# EasyEDA Pro project ProPrj_FOC_Driver V2.0_2024-06-09.epro, schematic v1.0
Create Date: 2023-11-04; Page Name: FOC_Driver; Project Name: FOC_Driver; Schematic Name: Schematic1; Update Date: 2024-03-01; Company: 嘉立创EDA; Page Size: A2; Version: V1.0
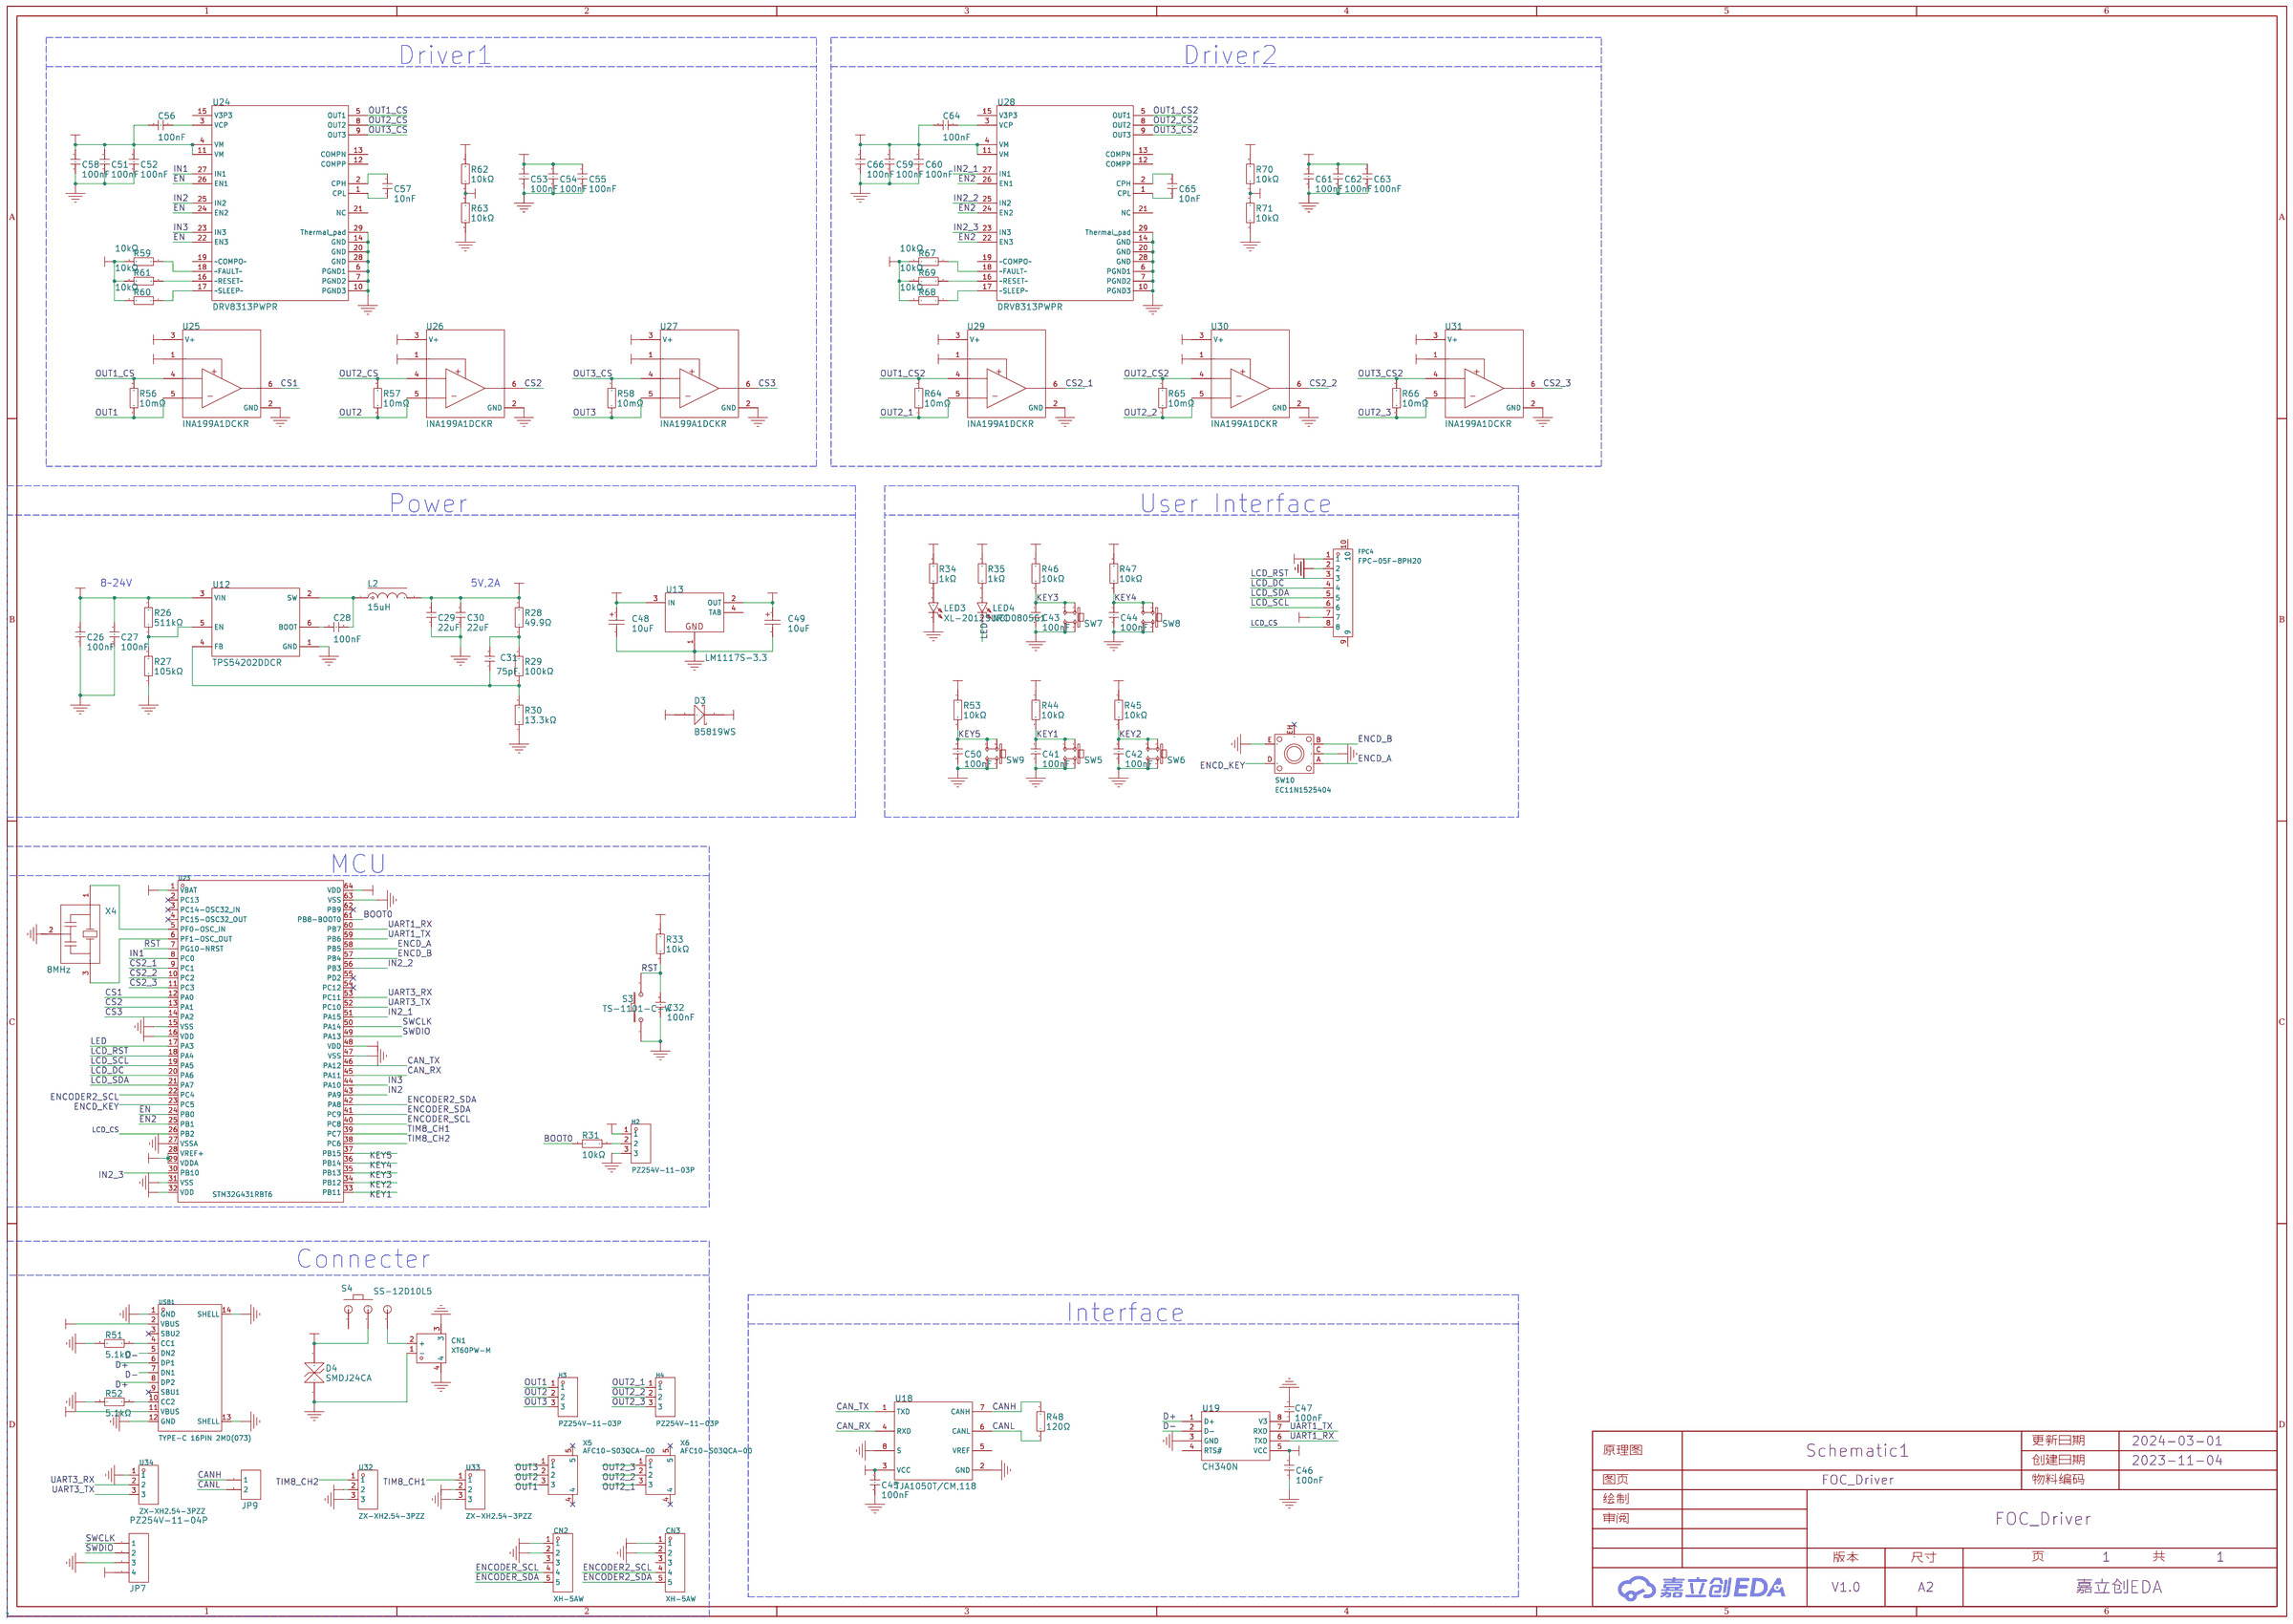
[diagram p0: schematic sheet]

## Parts
C26  100nF  [C0603]
C27  100nF  [C0603]
C28  100nF  [C0603]
C29  22uF  [C0805]
C30  22uF  [C0805]
C31  75pF  [C0603]
C32  100nF  [C0603]
C41  100nF  [C0603]
C42  100nF  [C0603]
C43  100nF  [C0603]
C44  100nF  [C0603]
C45  100nF  [C0603]
C46  100nF  [C0603]
C47  100nF  [C0603]
C48  10uF  [CAP-SMD_L3.2-W1.6-RD-C7171]
C49  10uF  [CAP-SMD_L3.2-W1.6-RD-C7171]
C50  100nF  [C0603]
C51  100nF  [C0603]
C52  100nF  [C0603]
C53  100nF  [C0603]
C54  100nF  [C0603]
C55  100nF  [C0603]
C56  100nF  [C0603]
C57  10nF  [C0603]
C58  100nF  [C0603]
C59  100nF  [C0603]
C60  100nF  [C0603]
C61  100nF  [C0603]
C62  100nF  [C0603]
C63  100nF  [C0603]
C64  100nF  [C0603]
C65  10nF  [C0603]
C66  100nF  [C0603]
CN1  XT60PW-M  [CONN-TH_XT60PW-M]
CN2  XH-5AW  [CONN-TH_5P-P2.54_XH-5AW_C2908614]
CN3  XH-5AW  [CONN-TH_5P-P2.54_XH-5AW_C2908614]
D3  B5819WS  [SOD-323_L1.8-W1.3-LS2.5-RD]
D4  SMDJ24CA  [SMC_L6.9-W5.9-LS7.9-BI]
FPC4  FPC-05F-8PH20  [FPC-SMD_8P-P0.50_FPC-05F-8PH20]
H2  PZ254V-11-03P  [HDR-TH_3P-P2.54-V-M]
H3  PZ254V-11-03P  [HDR-TH_3P-P2.54-V-M]
H4  PZ254V-11-03P  [HDR-TH_3P-P2.54-V-M]
JP7  PZ254V-11-04P  [HDR-TH_4P-P2.54-V-M]
JP9  XH-2A  [CONN-TH_2P-P2.50_HCTL_XH-2A-X]
L2  15uH  [IND-SMD_L4.0-W4.0]
LED3  XL-2012SURC  [LED0805-RD_RED]
LED4  NCD0805G1  [LED0805-R-RD]
R26  511kΩ  [R0805]
R27  105kΩ  [R0603]
R28  49.9Ω  [R0603]
R29  100kΩ  [R0603]
R30  13.3kΩ  [R0603]
R31  10kΩ  [R0603]
R33  10kΩ  [R0603]
R34  1kΩ  [R0603]
R35  1kΩ  [R0603]
R44  10kΩ  [R0603]
R45  10kΩ  [R0603]
R46  10kΩ  [R0603]
R47  10kΩ  [R0603]
R48  120Ω  [R0603]
R51  5.1kΩ  [R0603]
R52  5.1kΩ  [R0603]
R53  10kΩ  [R0603]
R56  10mΩ  [RES-SMD_L6.4-W3.2-R2512]
R57  10mΩ  [RES-SMD_L6.4-W3.2-R2512]
R58  10mΩ  [RES-SMD_L6.4-W3.2-R2512]
R59  10kΩ  [R0603]
R60  10kΩ  [R0603]
R61  10kΩ  [R0603]
R62  10kΩ  [R0603]
R63  10kΩ  [R0603]
R64  10mΩ  [RES-SMD_L6.4-W3.2-R2512]
R65  10mΩ  [RES-SMD_L6.4-W3.2-R2512]
R66  10mΩ  [RES-SMD_L6.4-W3.2-R2512]
R67  10kΩ  [R0603]
R68  10kΩ  [R0603]
R69  10kΩ  [R0603]
R70  10kΩ  [R0603]
R71  10kΩ  [R0603]
S3  TS-1101-C-W  [SW-SMD_L6.0-W3.3-LS8.0]
S4  SS-12D10L5  [SW-TH_SS-12D10L5]
SW5  K2-1102SP-C3SC-04  [SW-SMD_4P-L6.0-W6.0-P4.50-LS9.0]
SW6  K2-1102SP-C3SC-04  [SW-SMD_4P-L6.0-W6.0-P4.50-LS9.0]
SW7  K2-1102SP-C3SC-04  [SW-SMD_4P-L6.0-W6.0-P4.50-LS9.0]
SW8  K2-1102SP-C3SC-04  [SW-SMD_4P-L6.0-W6.0-P4.50-LS9.0]
SW9  K2-1102SP-C3SC-04  [SW-SMD_4P-L6.0-W6.0-P4.50-LS9.0]
SW10  EC11N1525404  [SW-TH_EC11NXXXX]
U12  TPS54202DDCR  [SOT-23-6_L2.9-W1.6-P0.95-LS2.8-BL]
U13  LM1117S-3.3  [SOT-223-3_L6.5-W3.4-P2.30-LS7.0-BR]
U18  TJA1050T/CM,118  [SOIC-8_L5.0-W4.0-P1.27-LS6.0-BL]
U19  CH340N  [SOP-8_L4.9-W3.9-P1.27-LS6.0-BL]
U23  STM32G431RBT6  [LQFP-64_L10.0-W10.0-P0.50-LS12.0-BL]
U24  DRV8313PWPR  [HTSSOP-28_L9.8-W4.5-P0.65-LS6.6-BL-EP]
U25  INA199A1DCKR  [SC-70-6_L2.2-W1.3-P0.65-LS2.1-BR]
U26  INA199A1DCKR  [SC-70-6_L2.2-W1.3-P0.65-LS2.1-BR]
U27  INA199A1DCKR  [SC-70-6_L2.2-W1.3-P0.65-LS2.1-BR]
U28  DRV8313PWPR  [HTSSOP-28_L9.8-W4.5-P0.65-LS6.6-BL-EP]
U29  INA199A1DCKR  [SC-70-6_L2.2-W1.3-P0.65-LS2.1-BR]
U30  INA199A1DCKR  [SC-70-6_L2.2-W1.3-P0.65-LS2.1-BR]
U31  INA199A1DCKR  [SC-70-6_L2.2-W1.3-P0.65-LS2.1-BR]
U32  ZX-XH2.54-3PZZ  [CONN-TH_3P-P2.54_2501S-3P]
U33  ZX-XH2.54-3PZZ  [CONN-TH_3P-P2.54_2501S-3P]
U34  ZX-XH2.54-3PZZ  [CONN-TH_3P-P2.54_2501S-3P]
USB1  TYPE-C 16PIN 2MD(073)  [USB-C-SMD_TYPE-C-6PIN-2MD-073]
X4  8MHz  [OSC-SMD_3P-L3.2-W1.3-P1.2-L]
X5  AFC10-S03QCA-00  [CONN-SMD_AFC10-S03QCA-00]
X6  AFC10-S03QCA-00  [CONN-SMD_AFC10-S03QCA-00]

## Library data of the parts
C26 C58 C66 = CC0603KRX7R9BB104: 容值:100nF;精度:±10%;额定电压:50V;材质(温度系数):X7R;; LCSC Part Name: 100nF ±10% 50V; Supplier Part: C14663; Manufacturer: YAGEO(国巨); Supplier Footprint: 0603; JLCPCB Part Class: Basic Part; Datasheet: https://atta.szlcsc.com/upload/public/pdf/source/20180910/C282072_33301C7F631E79921B82A8DAC6BCC5B3.pdf; Supplier: LCSC; Tolerance: ±10%; Voltage Rated: 50V; Temperature Coefficient: X7R; Origin Footprint 1: C 1206_M; Design Item ID: C; Library Name: 0.1 - 电阻-电容-电感; BOM名称: 无极性贴片电容; 淘宝ID: 封装库来自淘宝 ID：黄晶宝石; 联系售后，技术支持: https://shop463601444.taobao.com; 唯一出售店铺网址: https://shop463601444.taobao.com; Origin Footprint 2: C 0201_L; Origin Footprint 3: C 0402_L; Origin Footprint 4: C 0603_L; Origin Footprint 5: C 0805_L; Origin Footprint 6: C 1206_L; Origin Footprint 7: C 1210_L; Origin Footprint 8: C 1808_L; Origin Footprint 9: C 1812_L; Origin Footprint 10: C 1825_L; Origin Footprint 11: C 2225_L; Origin Footprint 12: C 0201_M; Origin Footprint 13: C 0402_M; Origin Footprint 14: C 0603_M; Origin Footprint 15: C 0805_M; Origin Footprint 16: C 1210_M; Origin Footprint 17: C 1808_M; Origin Footprint 18: C 1812_M; Origin Footprint 19: C 1825_M; Origin Footprint 20: C 2225_M
C27 = CC0603KRX7R9BB104: 容值:100nF;精度:±10%;额定电压:50V;材质(温度系数):X7R;; LCSC Part Name: 100nF ±10% 50V; Supplier Part: C14663; Manufacturer: YAGEO(国巨); Supplier Footprint: 0603; JLCPCB Part Class: Basic Part; Datasheet: https://atta.szlcsc.com/upload/public/pdf/source/20180910/C282072_33301C7F631E79921B82A8DAC6BCC5B3.pdf; Supplier: LCSC; Tolerance: ±10%; Voltage Rated: 50V; Temperature Coefficient: X7R; Origin Footprint 1: C 0603_M; Design Item ID: C; Library Name: 0.1 - 电阻-电容-电感; BOM名称: 无极性贴片电容; 淘宝ID: 封装库来自淘宝 ID：黄晶宝石; 联系售后，技术支持: https://shop463601444.taobao.com; 唯一出售店铺网址: https://shop463601444.taobao.com; Origin Footprint 2: C 0201_L; Origin Footprint 3: C 0402_L; Origin Footprint 4: C 0603_L; Origin Footprint 5: C 0805_L; Origin Footprint 6: C 1206_L; Origin Footprint 7: C 1210_L; Origin Footprint 8: C 1808_L; Origin Footprint 9: C 1812_L; Origin Footprint 10: C 1825_L; Origin Footprint 11: C 2225_L; Origin Footprint 12: C 0201_M; Origin Footprint 13: C 0402_M; Origin Footprint 14: C 0805_M; Origin Footprint 15: C 1206_M; Origin Footprint 16: C 1210_M; Origin Footprint 17: C 1808_M; Origin Footprint 18: C 1812_M; Origin Footprint 19: C 1825_M; Origin Footprint 20: C 2225_M; Rated Voltage: 50V; Equivalent Series Resistance(ESR): 20Ω; Operating Temperature: -55℃~+125℃
C28 C41-C47 C50-C55 C59-C63 = 0603B104K500NT: 容值:100nF;精度:±10%;额定电压:50V;材质(温度系数):X7R;; LCSC Part Name: 100nF ±10% 50V; Supplier Part: C30926; Manufacturer: FH(风华); Supplier Footprint: 0603; JLCPCB Part Class: Extended Part; Datasheet: https://atta.szlcsc.com/upload/public/pdf/source/20170923/C30926_1506149436298988724.pdf; Supplier: LCSC; Tolerance: ±10%; Voltage Rated: 50V; Temperature Coefficient: X7R; Origin Footprint 1: C 0603_M; Design Item ID: C; Library Name: 0.1 - 电阻-电容-电感; BOM名称: 无极性贴片电容; 淘宝ID: 封装库来自淘宝 ID：黄晶宝石; 联系售后，技术支持: https://shop463601444.taobao.com; 唯一出售店铺网址: https://shop463601444.taobao.com; Origin Footprint 2: C 0201_L; Origin Footprint 3: C 0402_L; Origin Footprint 4: C 0603_L; Origin Footprint 5: C 0805_L; Origin Footprint 6: C 1206_L; Origin Footprint 7: C 1210_L; Origin Footprint 8: C 1808_L; Origin Footprint 9: C 1812_L; Origin Footprint 10: C 1825_L; Origin Footprint 11: C 2225_L; Origin Footprint 12: C 0201_M; Origin Footprint 13: C 0402_M; Origin Footprint 14: C 0805_M; Origin Footprint 15: C 1206_M; Origin Footprint 16: C 1210_M; Origin Footprint 17: C 1808_M; Origin Footprint 18: C 1812_M; Origin Footprint 19: C 1825_M; Origin Footprint 20: C 2225_M
C29 C30 = CL21A226MAQNNNE_C45783: 容值:22uF;精度:±20%;额定电压:25V;材质(温度系数):X5R;; LCSC Part Name: 22uF ±20% 25V; Supplier Part: C45783; Manufacturer: SAMSUNG(三星); Manufacturer Part: CL21A226MAQNNNE; Supplier Footprint: 0805; JLCPCB Part Class: Basic Part; Datasheet: https://atta.szlcsc.com/upload/public/pdf/source/20160218/1457707763339.pdf; Supplier: LCSC; Tolerance: ±20%; Voltage Rated: 25V; Temperature Coefficient: X5R; Origin Footprint 1: C 1206_M; Design Item ID: C; Library Name: 0.1 - 电阻-电容-电感; BOM名称: 无极性贴片电容; 淘宝ID: 封装库来自淘宝 ID：黄晶宝石; 联系售后，技术支持: https://shop463601444.taobao.com; 唯一出售店铺网址: https://shop463601444.taobao.com; Origin Footprint 2: C 0201_L; Origin Footprint 3: C 0402_L; Origin Footprint 4: C 0603_L; Origin Footprint 5: C 0805_L; Origin Footprint 6: C 1206_L; Origin Footprint 7: C 1210_L; Origin Footprint 8: C 1808_L; Origin Footprint 9: C 1812_L; Origin Footprint 10: C 1825_L; Origin Footprint 11: C 2225_L; Origin Footprint 12: C 0201_M; Origin Footprint 13: C 0402_M; Origin Footprint 14: C 0603_M; Origin Footprint 15: C 0805_M; Origin Footprint 16: C 1210_M; Origin Footprint 17: C 1808_M; Origin Footprint 18: C 1812_M; Origin Footprint 19: C 1825_M; Origin Footprint 20: C 2225_M
C31 = CC0603JRNPO9BN750: 容值:75pF;精度:±5%;额定电压:50V;材质(温度系数):NP0;; LCSC Part Name: 75pF ±5% 50V; Supplier Part: C282074; Manufacturer: YAGEO(国巨); Supplier Footprint: 0603; JLCPCB Part Class: Extended Part; Datasheet: https://atta.szlcsc.com/upload/public/pdf/source/20180910/C282074_CCE1E273F5501B7CA79887634C3253BB.pdf; Supplier: LCSC; Tolerance: ±5%; Voltage Rated: 50V; Temperature Coefficient: NP0; Origin Footprint 1: C 0603_M; Design Item ID: C; Library Name: 0.1 - 电阻-电容-电感; BOM名称: 无极性贴片电容; 淘宝ID: 封装库来自淘宝 ID：黄晶宝石; 联系售后，技术支持: https://shop463601444.taobao.com; 唯一出售店铺网址: https://shop463601444.taobao.com; Origin Footprint 2: C 0201_L; Origin Footprint 3: C 0402_L; Origin Footprint 4: C 0603_L; Origin Footprint 5: C 0805_L; Origin Footprint 6: C 1206_L; Origin Footprint 7: C 1210_L; Origin Footprint 8: C 1808_L; Origin Footprint 9: C 1812_L; Origin Footprint 10: C 1825_L; Origin Footprint 11: C 2225_L; Origin Footprint 12: C 0201_M; Origin Footprint 13: C 0402_M; Origin Footprint 14: C 0805_M; Origin Footprint 15: C 1206_M; Origin Footprint 16: C 1210_M; Origin Footprint 17: C 1808_M; Origin Footprint 18: C 1812_M; Origin Footprint 19: C 1825_M; Origin Footprint 20: C 2225_M
C32 = 0603B104K500NT: 容值:100nF;精度:±10%;额定电压:50V;材质(温度系数):X7R;; LCSC Part Name: 100nF ±10% 50V; Supplier Part: C30926; Manufacturer: FH(风华); Supplier Footprint: 0603; JLCPCB Part Class: Extended Part; Datasheet: https://atta.szlcsc.com/upload/public/pdf/source/20170923/C30926_1506149436298988724.pdf; Supplier: LCSC; Tolerance: ±10%; Voltage Rated: 50V; Temperature Coefficient: X7R; Origin Footprint 1: C 0603_L; Design Item ID: C; Library Name: 0.1 - 电阻-电容-电感; BOM名称: 无极性贴片电容; 淘宝ID: 封装库来自淘宝 ID：黄晶宝石; 联系售后，技术支持: https://shop463601444.taobao.com; 唯一出售店铺网址: https://shop463601444.taobao.com; Origin Footprint 2: C 0201_L; Origin Footprint 3: C 0402_L; Origin Footprint 4: C 0805_L; Origin Footprint 5: C 1206_L; Origin Footprint 6: C 1210_L; Origin Footprint 7: C 1808_L; Origin Footprint 8: C 1812_L; Origin Footprint 9: C 1825_L; Origin Footprint 10: C 2225_L; Origin Footprint 11: C 0201_M; Origin Footprint 12: C 0402_M; Origin Footprint 13: C 0603_M; Origin Footprint 14: C 0805_M; Origin Footprint 15: C 1206_M; Origin Footprint 16: C 1210_M; Origin Footprint 17: C 1808_M; Origin Footprint 18: C 1812_M; Origin Footprint 19: C 1825_M; Origin Footprint 20: C 2225_M
C48 C49 = TAJA106K016RNJ: 容值:10uF;精度:±10%;额定电压:16V;等效串联电阻:3Ω@100kHz;; LCSC Part Name: 10uF ±10% 16V; Supplier Part: C7171; Manufacturer: Kyocera AVX; Supplier Footprint: CASE-A-3216; JLCPCB Part Class: Basic Part; Datasheet: https://atta.szlcsc.com/upload/public/pdf/source/20160107/1457707748093.pdf; Supplier: LCSC; Tolerance: ±10%; Rated Voltage: 16V; Equivalent Series Resistance(ESR): 3Ω@100kHz; Operating Temperature: -55℃~+125℃; Voltage Rated: 25V; Temperature Coefficient: X5R; Design Item ID: CMP-1661-00004-1; Library Name: Altium Content Vault; Min Operating Temperature: -55 degC; Width: 1.7 mm; ComponentLink2URL: http://datasheets.avx.com/TAJ.pdf; PackageDescription: 2-Pin Surface Mount Device, Body 3.2 x 1.65 mm; RoHSCompliant: true; ComponentLink2Description: Datasheet; Package Quantity: 3000; Max Operating Temperature: 150 degC; Length: 3.1 mm; Frequency: 300 MHz; Mount: Surface Mount; Vce Max: 500 mV; Packaging: Tape and Reel; ComponentLink1URL: http://www.avx.com/; ComponentLink1Description: Manufacturer URL; DatasheetVersion: Feb-16; ComponentLink3URL: http://www.avx.com/download/software/literature/AVX-Footprint-Library.pdf; ComponentLink3Description: Package Specification; hFE Min: 60; Elements: 2; Height: 1.3 mm; PackageReference: CAPMP3217X18-T; Case\Package: SOT-26; REACH SVHC: No SVHC; Pins: 6; Radiation Hardening: No; Max Power Dissipation: 300 mW
C56 C64 = CC0603KRX7R7BB104: 容值:100nF;精度:±10%;额定电压:16V;材质(温度系数):X7R;; LCSC Part Name: 100nF ±10% 16V; Supplier Part: C108079; Manufacturer: YAGEO(国巨); Supplier Footprint: 0603; JLCPCB Part Class: Extended Part; Datasheet: https://atta.szlcsc.com/upload/public/pdf/source/20180521/C108079_E7FC8AA4882E2CE01D16840ADD99E4BD.pdf; Supplier: LCSC; Tolerance: ±10%; Voltage Rated: 16V; Temperature Coefficient: X7R; Origin Footprint 1: C 0603_M; Design Item ID: C; Library Name: 0.1 - 电阻-电容-电感; BOM名称: 无极性贴片电容; 淘宝ID: 封装库来自淘宝 ID：黄晶宝石; 联系售后，技术支持: https://shop463601444.taobao.com; 唯一出售店铺网址: https://shop463601444.taobao.com; Origin Footprint 2: C 0201_L; Origin Footprint 3: C 0402_L; Origin Footprint 4: C 0603_L; Origin Footprint 5: C 0805_L; Origin Footprint 6: C 1206_L; Origin Footprint 7: C 1210_L; Origin Footprint 8: C 1808_L; Origin Footprint 9: C 1812_L; Origin Footprint 10: C 1825_L; Origin Footprint 11: C 2225_L; Origin Footprint 12: C 0201_M; Origin Footprint 13: C 0402_M; Origin Footprint 14: C 0805_M; Origin Footprint 15: C 1206_M; Origin Footprint 16: C 1210_M; Origin Footprint 17: C 1808_M; Origin Footprint 18: C 1812_M; Origin Footprint 19: C 1825_M; Origin Footprint 20: C 2225_M
C57 C65 = CC0603KRX7R0BB103: 容值:10nF;精度:±10%;额定电压:100V;材质(温度系数):X7R;; LCSC Part Name: 10nF ±10% 100V; Supplier Part: C107059; Manufacturer: YAGEO(国巨); Supplier Footprint: 0603; JLCPCB Part Class: Extended Part; Datasheet: https://atta.szlcsc.com/upload/public/pdf/source/20180327/C107059_A5496CC52303C7A95A2E44D09B52A486.pdf; Supplier: LCSC; Tolerance: ±10%; Voltage Rated: 100V; Temperature Coefficient: X7R; Origin Footprint 1: C 0603_M; Design Item ID: C; Library Name: 0.1 - 电阻-电容-电感; BOM名称: 无极性贴片电容; 淘宝ID: 封装库来自淘宝 ID：黄晶宝石; 联系售后，技术支持: https://shop463601444.taobao.com; 唯一出售店铺网址: https://shop463601444.taobao.com; Origin Footprint 2: C 0201_L; Origin Footprint 3: C 0402_L; Origin Footprint 4: C 0603_L; Origin Footprint 5: C 0805_L; Origin Footprint 6: C 1206_L; Origin Footprint 7: C 1210_L; Origin Footprint 8: C 1808_L; Origin Footprint 9: C 1812_L; Origin Footprint 10: C 1825_L; Origin Footprint 11: C 2225_L; Origin Footprint 12: C 0201_M; Origin Footprint 13: C 0402_M; Origin Footprint 14: C 0805_M; Origin Footprint 15: C 1206_M; Origin Footprint 16: C 1210_M; Origin Footprint 17: C 1808_M; Origin Footprint 18: C 1812_M; Origin Footprint 19: C 1825_M; Origin Footprint 20: C 2225_M
CN1 = XT60PW-M: 模型锂电连接器; LCSC Part Name: AMASS(艾迈斯)航模插头xt90连接器150公母对接pw锂电池公头 板插卧式XT60PW-M; Supplier Part: C98732; Manufacturer: AMASS(艾迈斯); JLCPCB Part Class: Extended Part; Datasheet: https://atta.szlcsc.com/upload/public/pdf/source/20180125/C98732_15168617837851301983.pdf; Supplier: LCSC
CN2 CN3 = XH-5AW: 参考系列:XH;间距:2.54mm;插针结构:1x5P;排数:1;每排PIN数:5;行距:-;公母:公型插针;安装方式:弯插;额定电流:3A;工作温度范围:-25℃~+85℃;; LCSC Part Name: 系列:XH 间距:2.54mm 1x5P 弯插; Supplier Part: C2908614; Manufacturer: HCTL(华灿天禄); Supplier Footprint: 弯插,P=2.54mm; JLCPCB Part Class: Extended Part; Datasheet: https://atta.szlcsc.com/upload/public/pdf/source/20230711/B565BAF3B11666EF6B81B3605408F2BD.pdf; Supplier: LCSC; Reference Series: XH; Pitch: 2.54mm; Pins Structure: 1x5P; Number of Rows: 1; Number of PINs Per Row: 5; Gender: 公型插针; Mounting Style: 弯插; Current Rating (Max): 3A; Operating Temperature Range: -25℃~+85℃
D3 = B5819WS_C22624: 直流反向耐压(Vr):40V;平均整流电流(Io):1A;正向压降(Vf):600mV@1A;; LCSC Part Name: 40V 1A 600mV@1A; Supplier Part: C22624; Manufacturer: CJ(江苏长电/长晶); Supplier Footprint: SOD-323; JLCPCB Part Class: Extended Part; Datasheet: https://atta.szlcsc.com/upload/public/pdf/source/20170919/C22624_1505799673448977596.pdf; Supplier: LCSC; Reverse Voltage (Vr): 40V; Average Rectified Current (Io): 1A; Forward Voltage (Vf@If): 600mV@1A; Design Item ID: 1N5819; Library Name: 0.2 - 二极管-整流桥; BOM名称: 肖特基二极管; 欢迎光临: https://shop463601444.taobao.com; 淘宝ID: 封装库来自淘宝 ID：黄晶宝石; 属性: 40V/2A
D4 = SMDJ24CA_C511913: DO-214AB   3000W  VRWM=24V 双向 功率TVS 电源口等; Supplier Part: C511913; Manufacturer: BORN(伯恩半导体); Supplier Footprint: SMC; JLCPCB Part Class: Extended Part; Datasheet: https://atta.szlcsc.com/upload/public/pdf/source/20200413/C152077_2BEB0A19CF219C0016744A470088E912.pdf; Supplier: LCSC; Polarity: 双向; Reverse Stand-Off Voltage (Vrwm): 24V; Breakdown Voltage: 26.7V; Reverse Leakage Current (Ir): 1uA; Peak Pulse Current (Ipp)@10/1000μs: 15.5A; Maximum Clamping Voltage: 38.9V; Design Item ID: CMP-2000-07094-1; Library Name: Altium Content Vault; Clamping Voltage Vc Max: 38.9V; Peak Pulse Current Ippm: 14A; Mounting Technology: SurfaceMount; Package Reference: DO-214AA; Product Range: TRANSZORBSMBJSeries; Package Description: 2-Pin Surface Mount Device, Body 4.315 x 3.62 mm; Diode Case Style: DO-214AA; Power Dissipation Pd: 600W; Packaging: CutTape; Breakdown Voltage Min: 26.7V; Datasheet URL: http://www.vishay.com/docs/88392/smbj50a.pdf; No_ of Pins: 2Pins; Peak Pulse Power Dissipation: 600W; SVHC: ToBeAdvised; Manufacturer URL: http://www.vishay.com/; Breakdown Voltage Max: 29.5V; Datasheet Version: 02/2014; TVS Polarity: Bidirectional; Reverse Stand-Off Voltage Vrwm: 24V
FPC4 = FPC-05F-8PH20: 间距:0.5mm;触点数量:8P;锁定特性:翻盖式;安装类型:卧贴;触点类型:下接;工作温度范围:-25℃~+85℃;; LCSC Part Name: 0.5mm P数:8P 翻盖式 下接; Supplier Part: C2856797; Manufacturer: XUNPU(讯普); Supplier Footprint: SMD,P=0.5mm; JLCPCB Part Class: Extended Part; Datasheet: https://atta.szlcsc.com/upload/public/pdf/source/20210728/C2856796_EA80EFD10E16055FE067E7763B90421F.pdf; Supplier: LCSC; Pitch: 0.5mm; Number of Contacts: 8P; Locking Feature: 翻盖式; Mounting Type: 卧贴; Contact Type: 下接; Height Above Board: 2mm; FFC, FCB Thickness: 0.3mm; Operating Temperature Range: -25℃~+85℃
H2-H4 = PZ254V-11-03P: 排数:单排;总PIN位数:3;间距:2.54mm;插针结构:1x3P;行距:-;安装类型:直插;圆针/方针:方针;额定电流:3A;额定电压:250V;配合针长度:6mm;塑高:2.5mm;端接针长度:3mm;工作温度范围:-40℃~+105℃;颜色:黑色;; LCSC Part Name: 2.54mm 1x3P 直插 方针; Supplier Part: C2937625; Manufacturer: XFCN(兴飞); Supplier Footprint: 直插,P=2.54mm; JLCPCB Part Class: Extended Part; Datasheet: 2022-07-12/581362A/62b9d00620994b3696be7eb4af85ad72/双排排针和单排排针.pdf; Supplier: LCSC; Number of Rows: 单排; Number of Pins: 3; Pitch: 2.54mm; Pin Structure: 1x3P; Mounting Type: 直插; Circluar Pins/Square Pins: 方针; Current Rating (Max): 3A; Voltage Rating (Max): 250V; Length of Mating Pin: 6mm; Insulation Height: 2.5mm; Length of End Connection Pin: 3mm; Operating Temperature Range: -40℃~+105℃; Color: 黑色
JP7 = PZ254V-11-04P: 排数:单排;总PIN位数:4P;间距:2.54mm;插针结构:1x4P;行距:-;安装类型:直插;圆针/方针:方针;额定电流:3A;额定电压:250V;配合针长度:6mm;塑高:2.5mm;端接针长度:3mm;触头材质:-;工作温度范围:-40℃~+105℃;颜色:黑色;; LCSC Part Name: 2.54mm 1x4P 直插 方针; Supplier Part: C2691448; Manufacturer: XFCN(兴飞); Supplier Footprint: 插件,P=2.54mm; JLCPCB Part Class: Extended Part; Datasheet: https://atta.szlcsc.com/upload/public/pdf/source/20200309/C492403_F9F19131791D08044AD4F84F8E751A34.pdf; Supplier: LCSC; Number of Rows: 单排; Number of Pins: 4P; Pitch: 2.54mm; Pin Structure: 1x4P; Mounting Type: 直插; Circluar Pins/Square Pins: 方针; Current Rating (Max): 3A; Voltage Rating (Max): 250V; Length of Mating Pin: 6mm; Insulation Height: 2.5mm; Length of End Connection Pin: 3mm; Operating Temperature Range: -40℃~+105℃; Color: 黑色; Origin Footprint 1: HDR2.54-LI-4P; Design Item ID: Header 4; Library Name: 5.4 - 接插件-脚距2.54 (100mil); BOM名称: 4P接插件; 版权归属: 封装库来自淘宝 ID：黄晶宝石; 学习资源: https://shop463601444.taobao.com; Origin Footprint 2: XH2.54-WI-4P; Origin Footprint 3: XH2.54-LI-4P; Origin Footprint 4: HDR2.54-M-LI-4P; Origin Footprint 5: HDR2.54-WI-4P; Origin Footprint 6: HDR2.54-WS-4P; Origin Footprint 7: HDR2.54-Y-LI-4P; Origin Footprint 8: HDR2.54-M-WS-4P; Origin Footprint 9: KF2510-LI-4P; Origin Footprint 10: XH2.54-WS-4P; Origin Footprint 11: XH2.54-LS-4P; Origin Footprint 12: KF2EDGK-2.54-LI-4P; Origin Footprint 13: KF2EDGK-2.54-WI-4P
JP9 = XH-2A: 参考系列:XH;间距:2.5mm;插针结构:1x2P;排数:1;每排PIN数:2;行距:-;公母:公型插针;安装方式:直插;额定电流:3A;工作温度范围:-25℃~+85℃;; LCSC Part Name: 系列:XH 间距:2.5mm 1x2P 直插; Supplier Part: C2908600; Manufacturer: HCTL(华灿天禄); Supplier Footprint: 插件,P=2.5mm; JLCPCB Part Class: Extended Part; Datasheet: https://atta.szlcsc.com/upload/public/pdf/source/20230711/68D365716984B4AFE576D1D73D61B465.pdf; Supplier: LCSC; Reference Series: XH; Pitch: 2.5mm; Pins Structure: 1x2P; Number of Rows: 1; Number of PINs Per Row: 2; Gender: 公型插针; Mounting Style: 直插; Current Rating (Max): 3A; Operating Temperature Range: -25℃~+85℃; Origin Footprint 1: KF301-5.0-2P; Design Item ID: Header 2; Library Name: 6.0 - 接插件-脚距5.0; BOM名称: 2P接插件; 版权归属: 封装库来自淘宝 ID：黄晶宝石; 技术支持，联系售后: https://shop463601444.taobao.com; Origin Footprint 2: KF2EDGK5.0-LI-2P; Origin Footprint 3: KF2EDGK5.0-WI-2P
L2 = YNR4030-150M: 电感值:15uH;精度:±20%;额定电流:1.11A;; LCSC Part Name: 15uH ±20% 1.11A 190mΩ; Supplier Part: C340394; Manufacturer: YJYCOIN(益嘉源); Supplier Footprint: SMD,4x4x3mm; JLCPCB Part Class: Extended Part; Datasheet: https://atta.szlcsc.com/upload/public/pdf/source/20200623/C340386_9AA10DB3E9692149FF2BB278AFBCE083.pdf; Supplier: LCSC; Tolerance: ±20%; Rated Current: 1.11A; DC Resistance (DCR): 190mΩ; Origin Footprint 1: CDRH73; Design Item ID: L-CDRH; Library Name: 0.1 - 电阻-电容-电感; BOM名称: 功率屏蔽电感; 联系售后: https://shop463601444.taobao.com; 版权归属: 封装库来自淘宝 ID：黄晶宝石; Origin Footprint 2: CDRH74; Origin Footprint 3: CDRH124; Origin Footprint 4: CDRH125; Origin Footprint 5: CDRH127; Origin Footprint 6: CDRH129
LED3 = XL-2012SURC: 发光颜色:红灯;主波长:617nm~621nm;色温:-;功率:55mW;安装方式:正贴;; LCSC Part Name: 红灯 正贴; Supplier Part: C965812; Manufacturer: XINGLIGHT(成兴光); Supplier Footprint: 0805; JLCPCB Part Class: Extended Part; Datasheet: https://atta.szlcsc.com/upload/public/pdf/source/20221102/49E1A0A365644091E6270AF1C5E0FE37.pdf; Supplier: LCSC; Emitted Color: 红灯; Lens Color: 无色透明; Dominant Wavelength: 617nm~621nm; Peak Wavelength: 623nm; Forward Current: 25mA; Power Dissipation: 55mW; Viewing Angle: 120°; Mounting Sytle: 正贴; Operating Temperature: -30℃~+85℃; Origin Footprint 1: LED 0603R; Design Item ID: LED-SMD; Library Name: 0.3 - LED发光二极管; BOM名称: 贴片LED; 学习资源: https://shop463601444.taobao.com; 版权归属: 封装库来自淘宝 ID：黄晶宝石; Origin Footprint 2: LED 0603W; Origin Footprint 3: LED 0603B; Origin Footprint 4: LED 0603G; Origin Footprint 5: LED 0603Y; Origin Footprint 6: LED 0805G; Origin Footprint 7: LED 0805R; Origin Footprint 8: LED 0805B; Origin Footprint 9: LED 0805Y; Origin Footprint 10: LED 3528-2Pin; Origin Footprint 11: LED 1206G; Origin Footprint 12: LED 5730-V; Origin Footprint 13: LED 1206Y; Origin Footprint 14: LED 0805W; Origin Footprint 15: LED 1206B; Origin Footprint 16: LED 1206W; Origin Footprint 17: LED 1206R
LED4 = NCD0805G1: 发光颜色:翠绿;; LCSC Part Name: 翠绿 0805翠绿  正贴; Supplier Part: C84260; Manufacturer: 国星光电; Supplier Footprint: 0805; JLCPCB Part Class: Extended Part; Datasheet: https://atta.szlcsc.com/upload/public/pdf/source/20200820/C84260_AFC7BF57C6FBA034D182BB8D10A67EFE.pdf; Supplier: LCSC; Emitted Color: 翠绿; Origin Footprint 1: LED 0603R; Design Item ID: LED-SMD; Library Name: 0.3 - LED发光二极管; BOM名称: 贴片LED; 学习资源: https://shop463601444.taobao.com; 版权归属: 封装库来自淘宝 ID：黄晶宝石; Origin Footprint 2: LED 0603W; Origin Footprint 3: LED 0603B; Origin Footprint 4: LED 0603G; Origin Footprint 5: LED 0603Y; Origin Footprint 6: LED 0805G; Origin Footprint 7: LED 0805R; Origin Footprint 8: LED 0805B; Origin Footprint 9: LED 0805Y; Origin Footprint 10: LED 3528-2Pin; Origin Footprint 11: LED 1206G; Origin Footprint 12: LED 5730-V; Origin Footprint 13: LED 1206Y; Origin Footprint 14: LED 0805W; Origin Footprint 15: LED 1206B; Origin Footprint 16: LED 1206W; Origin Footprint 17: LED 1206R
R26 = 0805W8F5113T5E: 电阻类型:厚膜电阻;阻值:511kΩ;精度:±1%;功率:125mW;温度系数:±100ppm/℃;; LCSC Part Name: 厚膜电阻 511kΩ ±1% 125mW; Supplier Part: C17735; Manufacturer: UNI-ROYAL(厚声); Supplier Footprint: 0805; JLCPCB Part Class: Extended Part; Datasheet: https://atta.szlcsc.com/upload/public/pdf/source/20200306/C422600_1E6D84923E4A46A82E41ADD87F860B5C.pdf; Supplier: LCSC; Type: 厚膜电阻; Tolerance: ±1%; Power(Watts): 125mW; Temperature Coefficient: ±100ppm/℃; Overload Voltage (Max): 150V; Operating Temperature Range: -55℃~+155℃; Origin Footprint 1: R 0603_M; Design Item ID: R; Library Name: 0.1 - 电阻-电容-电感; BOM名称: 贴片电阻; 联系售后: https://shop463601444.taobao.com; 版权归属: 来自淘宝 ID：黄晶宝石; 封装库来自淘宝卖家 ID：黄晶宝石: 其他店铺购入均为盗版，不享受售后技术支持服务，请立即申请退款; Origin Footprint 2: R 0201_L; Origin Footprint 3: R 0402_L; Origin Footprint 4: R 0603_L; Origin Footprint 5: R 0805_L; Origin Footprint 6: R 1206_L; Origin Footprint 7: R 1210_L; Origin Footprint 8: R 1812_L; Origin Footprint 9: R 2010_L; Origin Footprint 10: R 2512_L; Origin Footprint 11: R 0201_M; Origin Footprint 12: R 0402_M; Origin Footprint 13: R 0805_M; Origin Footprint 14: R 1206_M; Origin Footprint 15: R 1210_M; Origin Footprint 16: R 1812_M; Origin Footprint 17: R 2010_M; Origin Footprint 18: R 2512_M
R27 = 0603WAF1053T5E: 电阻类型:厚膜电阻;阻值:105kΩ;精度:±1%;功率:100mW;; LCSC Part Name: 105kΩ ±1% 100mW; Supplier Part: C16840; Manufacturer: UNI-ROYAL(厚声); Supplier Footprint: 0603; JLCPCB Part Class: Extended Part; Datasheet: https://atta.szlcsc.com/upload/public/pdf/source/20200306/C422600_1E6D84923E4A46A82E41ADD87F860B5C.pdf; Supplier: LCSC; Type: 厚膜电阻; Tolerance: ±1%; Power(Watts): 100mW; Temperature Coefficient: ±100ppm/℃; Overload Voltage (Max): 75V; Operating Temperature Range: -55℃~+155℃; Origin Footprint 1: R 0603_M; Design Item ID: R; Library Name: 0.1 - 电阻-电容-电感; BOM名称: 贴片电阻; 联系售后: https://shop463601444.taobao.com; 版权归属: 来自淘宝 ID：黄晶宝石; 封装库来自淘宝卖家 ID：黄晶宝石: 其他店铺购入均为盗版，不享受售后技术支持服务，请立即申请退款; Origin Footprint 2: R 0201_L; Origin Footprint 3: R 0402_L; Origin Footprint 4: R 0603_L; Origin Footprint 5: R 0805_L; Origin Footprint 6: R 1206_L; Origin Footprint 7: R 1210_L; Origin Footprint 8: R 1812_L; Origin Footprint 9: R 2010_L; Origin Footprint 10: R 2512_L; Origin Footprint 11: R 0201_M; Origin Footprint 12: R 0402_M; Origin Footprint 13: R 0805_M; Origin Footprint 14: R 1206_M; Origin Footprint 15: R 1210_M; Origin Footprint 16: R 1812_M; Origin Footprint 17: R 2010_M; Origin Footprint 18: R 2512_M
R28 = 0603WAF499JT5E: 电阻类型:厚膜电阻;阻值:49.9Ω;精度:±1%;功率:100mW;温度系数:±100ppm/℃;; LCSC Part Name: 厚膜电阻 49.9Ω ±1% 100mW; Supplier Part: C23185; Manufacturer: UNI-ROYAL(厚声); Supplier Footprint: 0603; JLCPCB Part Class: Basic Part; Datasheet: https://atta.szlcsc.com/upload/public/pdf/source/20200306/C422600_1E6D84923E4A46A82E41ADD87F860B5C.pdf; Supplier: LCSC; Type: 厚膜电阻; Tolerance: ±1%; Power(Watts): 100mW; Temperature Coefficient: ±100ppm/℃; Overload Voltage (Max): 75V; Operating Temperature Range: -55℃~+155℃; Origin Footprint 1: R 0603_M; Design Item ID: R; Library Name: 0.1 - 电阻-电容-电感; BOM名称: 贴片电阻; 联系售后: https://shop463601444.taobao.com; 版权归属: 来自淘宝 ID：黄晶宝石; 封装库来自淘宝卖家 ID：黄晶宝石: 其他店铺购入均为盗版，不享受售后技术支持服务，请立即申请退款; Origin Footprint 2: R 0201_L; Origin Footprint 3: R 0402_L; Origin Footprint 4: R 0603_L; Origin Footprint 5: R 0805_L; Origin Footprint 6: R 1206_L; Origin Footprint 7: R 1210_L; Origin Footprint 8: R 1812_L; Origin Footprint 9: R 2010_L; Origin Footprint 10: R 2512_L; Origin Footprint 11: R 0201_M; Origin Footprint 12: R 0402_M; Origin Footprint 13: R 0805_M; Origin Footprint 14: R 1206_M; Origin Footprint 15: R 1210_M; Origin Footprint 16: R 1812_M; Origin Footprint 17: R 2010_M; Origin Footprint 18: R 2512_M
R29 = 0603WAF1003T5E: 电阻类型:厚膜电阻;阻值:100kΩ;精度:±1%;功率:100mW;; LCSC Part Name: 100kΩ ±1% 100mW; Supplier Part: C25803; Manufacturer: UNI-ROYAL(厚声); Supplier Footprint: 0603; JLCPCB Part Class: Basic Part; Datasheet: https://atta.szlcsc.com/upload/public/pdf/source/20200306/C422600_1E6D84923E4A46A82E41ADD87F860B5C.pdf; Supplier: LCSC; Type: 厚膜电阻; Tolerance: ±1%; Power(Watts): 100mW; Temperature Coefficient: ±100ppm/℃; Overload Voltage (Max): 75V; Operating Temperature Range: -55℃~+155℃; Origin Footprint 1: R 0603_M; Design Item ID: R; Library Name: 0.1 - 电阻-电容-电感; BOM名称: 贴片电阻; 联系售后: https://shop463601444.taobao.com; 版权归属: 来自淘宝 ID：黄晶宝石; 封装库来自淘宝卖家 ID：黄晶宝石: 其他店铺购入均为盗版，不享受售后技术支持服务，请立即申请退款; Origin Footprint 2: R 0201_L; Origin Footprint 3: R 0402_L; Origin Footprint 4: R 0603_L; Origin Footprint 5: R 0805_L; Origin Footprint 6: R 1206_L; Origin Footprint 7: R 1210_L; Origin Footprint 8: R 1812_L; Origin Footprint 9: R 2010_L; Origin Footprint 10: R 2512_L; Origin Footprint 11: R 0201_M; Origin Footprint 12: R 0402_M; Origin Footprint 13: R 0805_M; Origin Footprint 14: R 1206_M; Origin Footprint 15: R 1210_M; Origin Footprint 16: R 1812_M; Origin Footprint 17: R 2010_M; Origin Footprint 18: R 2512_M
R30 = 0603WAF1332T5E: 电阻类型:厚膜电阻;阻值:13.3kΩ;精度:±1%;功率:100mW;温度系数:±100ppm/℃;; LCSC Part Name: 厚膜电阻 13.3kΩ ±1% 100mW; Supplier Part: C25952; Manufacturer: UNI-ROYAL(厚声); Supplier Footprint: 0603; JLCPCB Part Class: Extended Part; Datasheet: https://atta.szlcsc.com/upload/public/pdf/source/20200306/C422600_1E6D84923E4A46A82E41ADD87F860B5C.pdf; Supplier: LCSC; Type: 厚膜电阻; Tolerance: ±1%; Power(Watts): 100mW; Temperature Coefficient: ±100ppm/℃; Overload Voltage (Max): 75V; Operating Temperature Range: -55℃~+155℃; Origin Footprint 1: R 0603_M; Design Item ID: R; Library Name: 0.1 - 电阻-电容-电感; BOM名称: 贴片电阻; 联系售后: https://shop463601444.taobao.com; 版权归属: 来自淘宝 ID：黄晶宝石; 封装库来自淘宝卖家 ID：黄晶宝石: 其他店铺购入均为盗版，不享受售后技术支持服务，请立即申请退款; Origin Footprint 2: R 0201_L; Origin Footprint 3: R 0402_L; Origin Footprint 4: R 0603_L; Origin Footprint 5: R 0805_L; Origin Footprint 6: R 1206_L; Origin Footprint 7: R 1210_L; Origin Footprint 8: R 1812_L; Origin Footprint 9: R 2010_L; Origin Footprint 10: R 2512_L; Origin Footprint 11: R 0201_M; Origin Footprint 12: R 0402_M; Origin Footprint 13: R 0805_M; Origin Footprint 14: R 1206_M; Origin Footprint 15: R 1210_M; Origin Footprint 16: R 1812_M; Origin Footprint 17: R 2010_M; Origin Footprint 18: R 2512_M
R31 R33 R44-R47 R53 R59-R63 R67-R71 = 0603WAF1002T5E: 电阻类型:厚膜电阻;阻值:10kΩ;精度:±1%;功率:100mW;; LCSC Part Name: 厚膜电阻 10kΩ ±1% 100mW; Supplier Part: C25804; Manufacturer: UNI-ROYAL(厚声); Supplier Footprint: 0603; JLCPCB Part Class: Basic Part; Datasheet: https://atta.szlcsc.com/upload/public/pdf/source/20200306/C422600_1E6D84923E4A46A82E41ADD87F860B5C.pdf; Supplier: LCSC; Type: 厚膜电阻; Tolerance: ±1%; Power(Watts): 100mW; Temperature Coefficient: ±100ppm/℃; Overload Voltage (Max): 75V; Operating Temperature Range: -55℃~+155℃; Origin Footprint 1: R 0603_M; Design Item ID: R; Library Name: 0.1 - 电阻-电容-电感; BOM名称: 贴片电阻; 联系售后: https://shop463601444.taobao.com; 版权归属: 来自淘宝 ID：黄晶宝石; 封装库来自淘宝卖家 ID：黄晶宝石: 其他店铺购入均为盗版，不享受售后技术支持服务，请立即申请退款; Origin Footprint 2: R 0201_L; Origin Footprint 3: R 0402_L; Origin Footprint 4: R 0603_L; Origin Footprint 5: R 0805_L; Origin Footprint 6: R 1206_L; Origin Footprint 7: R 1210_L; Origin Footprint 8: R 1812_L; Origin Footprint 9: R 2010_L; Origin Footprint 10: R 2512_L; Origin Footprint 11: R 0201_M; Origin Footprint 12: R 0402_M; Origin Footprint 13: R 0805_M; Origin Footprint 14: R 1206_M; Origin Footprint 15: R 1210_M; Origin Footprint 16: R 1812_M; Origin Footprint 17: R 2010_M; Origin Footprint 18: R 2512_M
R34 R35 = 0603WAF1001T5E: 电阻类型:厚膜电阻;阻值:1kΩ;精度:±1%;功率:100mW;温度系数:±100ppm/℃;; LCSC Part Name: 厚膜电阻 1kΩ ±1% 100mW; Supplier Part: C21190; Manufacturer: UNI-ROYAL(厚声); Supplier Footprint: 0603; JLCPCB Part Class: Basic Part; Datasheet: https://atta.szlcsc.com/upload/public/pdf/source/20200306/C422600_1E6D84923E4A46A82E41ADD87F860B5C.pdf; Supplier: LCSC; Type: 厚膜电阻; Tolerance: ±1%; Power(Watts): 100mW; Temperature Coefficient: ±100ppm/℃; Overload Voltage (Max): 75V; Operating Temperature Range: -55℃~+155℃; Origin Footprint 1: R 0603_M; Design Item ID: R; Library Name: 0.1 - 电阻-电容-电感; BOM名称: 贴片电阻; 联系售后: https://shop463601444.taobao.com; 版权归属: 来自淘宝 ID：黄晶宝石; 封装库来自淘宝卖家 ID：黄晶宝石: 其他店铺购入均为盗版，不享受售后技术支持服务，请立即申请退款; Origin Footprint 2: R 0201_L; Origin Footprint 3: R 0402_L; Origin Footprint 4: R 0603_L; Origin Footprint 5: R 0805_L; Origin Footprint 6: R 1206_L; Origin Footprint 7: R 1210_L; Origin Footprint 8: R 1812_L; Origin Footprint 9: R 2010_L; Origin Footprint 10: R 2512_L; Origin Footprint 11: R 0201_M; Origin Footprint 12: R 0402_M; Origin Footprint 13: R 0805_M; Origin Footprint 14: R 1206_M; Origin Footprint 15: R 1210_M; Origin Footprint 16: R 1812_M; Origin Footprint 17: R 2010_M; Origin Footprint 18: R 2512_M
R48 = 0603WAF1200T5E: 电阻类型:厚膜电阻;阻值:120Ω;精度:±1%;功率:100mW;温度系数:±100ppm/℃;; LCSC Part Name: 厚膜电阻 120Ω ±1% 100mW; Supplier Part: C22787; Manufacturer: UNI-ROYAL(厚声); Supplier Footprint: 0603; JLCPCB Part Class: Basic Part; Datasheet: https://atta.szlcsc.com/upload/public/pdf/source/20200306/C422600_1E6D84923E4A46A82E41ADD87F860B5C.pdf; Supplier: LCSC; Type: 厚膜电阻; Tolerance: ±1%; Power(Watts): 100mW; Temperature Coefficient: ±100ppm/℃; Overload Voltage (Max): 75V; Operating Temperature Range: -55℃~+155℃; Origin Footprint 1: R 0603_M; Design Item ID: R; Library Name: 0.1 - 电阻-电容-电感; BOM名称: 贴片电阻; 联系售后: https://shop463601444.taobao.com; 版权归属: 来自淘宝 ID：黄晶宝石; 封装库来自淘宝卖家 ID：黄晶宝石: 其他店铺购入均为盗版，不享受售后技术支持服务，请立即申请退款; Origin Footprint 2: R 0201_L; Origin Footprint 3: R 0402_L; Origin Footprint 4: R 0603_L; Origin Footprint 5: R 0805_L; Origin Footprint 6: R 1206_L; Origin Footprint 7: R 1210_L; Origin Footprint 8: R 1812_L; Origin Footprint 9: R 2010_L; Origin Footprint 10: R 2512_L; Origin Footprint 11: R 0201_M; Origin Footprint 12: R 0402_M; Origin Footprint 13: R 0805_M; Origin Footprint 14: R 1206_M; Origin Footprint 15: R 1210_M; Origin Footprint 16: R 1812_M; Origin Footprint 17: R 2010_M; Origin Footprint 18: R 2512_M
R51 R52 = 0603WAF5101T5E: 电阻类型:厚膜电阻;阻值:5.1kΩ;精度:±1%;功率:100mW;温度系数:±100ppm/℃;; LCSC Part Name: 厚膜电阻 5.1kΩ ±1% 100mW; Supplier Part: C23186; Manufacturer: UNI-ROYAL(厚声); Supplier Footprint: 0603; JLCPCB Part Class: Basic Part; Datasheet: https://atta.szlcsc.com/upload/public/pdf/source/20200306/C422600_1E6D84923E4A46A82E41ADD87F860B5C.pdf; Supplier: LCSC; Type: 厚膜电阻; Tolerance: ±1%; Power(Watts): 100mW; Temperature Coefficient: ±100ppm/℃; Overload Voltage (Max): 75V; Operating Temperature Range: -55℃~+155℃; Origin Footprint 1: R 0603_M; Design Item ID: R; Library Name: 0.1 - 电阻-电容-电感; BOM名称: 贴片电阻; 联系售后: https://shop463601444.taobao.com; 版权归属: 来自淘宝 ID：黄晶宝石; 封装库来自淘宝卖家 ID：黄晶宝石: 其他店铺购入均为盗版，不享受售后技术支持服务，请立即申请退款; Origin Footprint 2: R 0201_L; Origin Footprint 3: R 0402_L; Origin Footprint 4: R 0603_L; Origin Footprint 5: R 0805_L; Origin Footprint 6: R 1206_L; Origin Footprint 7: R 1210_L; Origin Footprint 8: R 1812_L; Origin Footprint 9: R 2010_L; Origin Footprint 10: R 2512_L; Origin Footprint 11: R 0201_M; Origin Footprint 12: R 0402_M; Origin Footprint 13: R 0805_M; Origin Footprint 14: R 1206_M; Origin Footprint 15: R 1210_M; Origin Footprint 16: R 1812_M; Origin Footprint 17: R 2010_M; Origin Footprint 18: R 2512_M
R56-R58 R64-R66 = HoJLR2512-3W-10mR-1%: 阻值:10mΩ;功率:3W;; LCSC Part Name: 10mΩ 3W; Supplier Part: C2903468; Manufacturer: Milliohm(毫欧); Supplier Footprint: 2512; JLCPCB Part Class: Extended Part; Datasheet: https://atta.szlcsc.com/upload/public/pdf/source/20211009/7525CABAB363C979E942C1DD41F1FEF0.pdf; Supplier: LCSC; Power(Watts): 3W; Origin Footprint 1: R 0805_M; Design Item ID: R; Library Name: 0.1 - 电阻-电容-电感; BOM名称: 贴片电阻; 联系售后: https://shop463601444.taobao.com; 版权归属: 来自淘宝 ID：黄晶宝石; 封装库来自淘宝卖家 ID：黄晶宝石: 其他店铺购入均为盗版，不享受售后技术支持服务，请立即申请退款; Origin Footprint 2: R 0201_L; Origin Footprint 3: R 0402_L; Origin Footprint 4: R 0603_L; Origin Footprint 5: R 0805_L; Origin Footprint 6: R 1206_L; Origin Footprint 7: R 1210_L; Origin Footprint 8: R 1812_L; Origin Footprint 9: R 2010_L; Origin Footprint 10: R 2512_L; Origin Footprint 11: R 0201_M; Origin Footprint 12: R 0402_M; Origin Footprint 13: R 0603_M; Origin Footprint 14: R 1206_M; Origin Footprint 15: R 1210_M; Origin Footprint 16: R 1812_M; Origin Footprint 17: R 2010_M; Origin Footprint 18: R 2512_M
S3 = TS-1101-C-W: 触点电流:50mA;额定电压(AC):-;额定电压(DC):12V;额定功率:-;绝缘电阻:-;电路结构:单刀单掷;安装方式:立贴;带灯:无;作用力:260gf;机械寿命:5万次;带支架:否;; LCSC Part Name: 立贴 6*3.6*2.5mm 轻触开关 一型3*6*2.5有白ZD b拉伸白色带淡绿按键 卷装; Supplier Part: C318938; Manufacturer: XKB Connectivity(中国星坤); Supplier Footprint: SMD; JLCPCB Part Class: Extended Part; Datasheet: https://atta.szlcsc.com/upload/public/pdf/source/20200227/C318938_C2E53B1EEDE37D980A33616AC086DE53.pdf; Supplier: LCSC; Contact Current: 50mA; Voltage Rating (DC): 12V; Circuit: 单刀单掷; Mounting Style: 立贴; Actuator Style: 矩形按钮; Actuator/Cap Color: 白色带淡绿; With Lamp: 无; Operating Force: 260gf; Mechanical Life: 5万次; Operating Temperature: -30℃~+85℃; Switch Length: 6mm; Switch Width: 3.6mm; Switch Height: 2.5mm; Strike Gundam: 否; Origin Footprint 1: SW_PB2_A1; Design Item ID: SW-PB; Library Name: 0.7 - 常用按键-开关; Published: 24-Mar-1999; LatestRevisionDate: 17-Jul-2002; LatestRevisionNote: Re-released for DXP Platform.; PackageReference: SPST-2; Publisher: Altium Limited; Origin Footprint 2: SW_PB2_C1; Origin Footprint 3: SW_PB2_B1
S4 = SS-12D10L5: 额定电流(DC):3A;额定电压(DC):125V;额定电流(AC):3A;额定电压(AC):125V;电路结构:单刀双掷;安装方式:直插;机械寿命:1万次;开关颜色:黑色;; LCSC Part Name: 柄长5mm 直插双档 滑动开关 大电流; Supplier Part: C319012; Manufacturer: XKB Connectivity(中国星坤); Supplier Footprint: 插件; JLCPCB Part Class: Extended Part; Datasheet: https://atta.szlcsc.com/upload/public/pdf/source/20211009/D6412F37AABE6F9459A6EE7FA4DAEADB.pdf; Supplier: LCSC; Current Rating (DC): 3A; Voltage Rating (DC): 125V; Current Rating (AC): 3A; Voltage Rating (AC): 125V; Circuit: 单刀双掷; Mounting Style: 直插; Mechanical Life: 1万次; Actuator Color: 黑色; Actuator Style: 矩形柱状; Pin Style: PC引脚; Operating Temperature: -40℃~+85℃; Switch Length: 13mm; Switch Width: 6.8mm; Switch Height: 6.4mm; Design Item ID: SS12D10; Library Name: 开关
SW5-SW9 = K2-1102SP-C3SC-04: 触点电流:50mA;额定电压(DC):12V;绝缘电阻:100MΩ;安装方式:立贴;作用力:180gf@±30gf;机械寿命:100000;工作温度:-25℃~+85℃;开关长度:6mm;开关宽度:6mm;开关高度:5mm;; LCSC Part Name: 6×6×5 180G; Supplier Part: C707347; Manufacturer: 韩国韩荣; Supplier Footprint: SMD; JLCPCB Part Class: Extended Part; Datasheet: https://atta.szlcsc.com/upload/public/pdf/source/20200721/C707346_4856918D8F54166BBF40C7F949AFDD95.pdf; Supplier: LCSC; Contact Current: 50mA; Voltage Rating (DC): 12V; Insulation Resistance: 100MΩ; Mounting Style: 立贴; Operating Force: 180gf@±30gf; Mechanical Life: 100000; Operating Temperature: -25℃~+85℃; Switch Length: 6mm; Switch Width: 6mm; Switch Height: 5mm; Origin Footprint 1: TSW SMD-6*6*4.3; Design Item ID: TSW SMD-6x6; Library Name: 0.7 - 常用按键-开关; BOM名称: 贴片6x6轻触开关; 唯一出售店铺网址: https://shop463601444.taobao.com; 版权归属: 封装库来自淘宝 ID：黄晶宝石; Origin Footprint 2: TSW SMD-6*6*5; Origin Footprint 3: TSW SMD-6*6*6; Origin Footprint 4: TSW SMD-6*6*7; Origin Footprint 5: TSW SMD-6*6*8; Origin Footprint 6: TSW SMD-6*6*9; Origin Footprint 7: TSW SMD-6*6*10; Origin Footprint 8: TSW SMD-6*6*12; Origin Footprint 9: TSW SMD-6*6*13; Origin Footprint 10: TSW SMD-6*6*14; Origin Footprint 11: TSW SMD-6*6*15
SW10 = EC11N1525404: Supplier Part: C470748; Manufacturer: ALPSALPINE(阿尔卑斯阿尔派); Supplier Footprint: 插件; JLCPCB Part Class: Extended Part; Datasheet: https://atta.szlcsc.com/upload/public/pdf/source/20191216/C470748_4553939063CED38716445BA711197973.pdf; Supplier: LCSC
U12 = TPS54202DDCR: 可输出电流:2A;开关工作频率:500kHz;输出类型:Adjustable;输出电压的路数:1;功能类型:Step-Down;输出配置:Positive;; Supplier Part: C191884; Manufacturer: TI(德州仪器); Supplier Footprint: SOT-23-6; JLCPCB Part Class: Extended Part; Datasheet: https://atta.szlcsc.com/upload/public/pdf/source/20181012/C191884_C6DBFD980275651BD8C8F427C2E48058.pdf; Supplier: LCSC; Origin Footprint 1: FP-DDC0006A-IPC_B; Design Item ID: CMP-04918-000439-1; Library Name: Altium Content Vault; Quiescent Current: 40uA; Max Input Voltage: 28V; Max Operating Temperature: 125°C; Min Input Voltage: 4.5V; Switching Frequency: 500kHz; Lead Free: Lead Free; Synchronous Rectifier: Yes; Min Operating Temperature: -40°C; RoHS Compliant: Yes; Case/Package: SOT-23-6; Min Output Voltage: 596mV; Max Output Voltage: 28V; Output Current: 2A; Packaging: Tape and Reel; Output Type: Adjustable; Number of Outputs: 1; Mount: Surface Mount; Output Configuration: Positive; Origin Footprint 2: FP-DDC0006A-IPC_A; Origin Footprint 3: FP-DDC0006A-IPC_C; Origin Footprint 4: FP-DDC0006A-MFG
U13 = LM1117S-3.3: 输出类型:固定;输出极性:正;最大输入电压:12V;输出电压:3.3V;输出电流:1A;电源纹波抑制比(PSRR):75dB@(120Hz);; LCSC Part Name: 输入12V 输出3.3V 1A; Supplier Part: C126027; Manufacturer: HTC; Supplier Footprint: SOT-223; JLCPCB Part Class: Extended Part; Datasheet: https://atta.szlcsc.com/upload/public/pdf/source/20170814/C126027_1502678373551885899.pdf; Supplier: LCSC; Output Type: 固定; Output Polarity: 正; Number of Outputs: 1; Maximum Input Voltage: 12V; Output Voltage: 3.3V; Dropout Voltage: 1.3V@(1A); Output Current: 1A; Power Supply Rejection Ratio (PSRR): 75dB@(120Hz); Origin Footprint 1: MP04A_M; Design Item ID: CMP-0062-01632-3; Library Name: Altium Content Vault; ComponentLink3Description: LM1117 Web Page; Code_JEDEC: TO-261-AA; CompType: LDO IC; PackageTopMarking: XYTT*N05B; RoHS: Y; PackageReference: MP04A; High-Reliability: Y; ComponentLink3URL: http://www.national.com/pf/LM/LM1117.html; RevisionNote: SCH symbol layout adjusted; ComponentLink2URL: http://www.national.com/ds/LM/LM1117.pdf; ComponentLink2Description: LM1117 Datasheet; ComponentLink1Description: Manufacturer URL; ComponentLink4Description: MP04A Package Page; ComponentLink4URL: http://www.national.com/packaging/folders/mp04a.html; PackageVersion: revB, Apr-2003; DatasheetVersion: Apr-2006; PackageDescription: Molded SOT-223, 6.50 x 3.56 x 1.6mm Body, 4 Lead, 2.3mm Pitch; Code_IPC: SOT223-4; ComponentLink1URL: http://www.national.com/; PinCount: 4; PowerWise: N; PartNumber: LM1117IMPX-3.3/NOPB; Origin Footprint 2: MP04A_L; Origin Footprint 3: MP04A_N
U18 = TJA1050T/CM,118: 类型:收发器;; LCSC Part Name: 4.75V~5.25V; Supplier Part: C6952; Manufacturer: NXP(恩智浦); Supplier Footprint: SOIC-8; JLCPCB Part Class: Basic Part; Datasheet: https://atta.szlcsc.com/upload/public/pdf/source/20140411/1457707042917.pdf; Supplier: LCSC; Type: 收发器; Supply Voltage: 4.75V~5.25V; Supply Current: 50mA; Origin Footprint 1: NXP-SOT96-1_M; Design Item ID: CMP-2000-04923-1; Library Name: Altium Content Vault; Standard Package: 1; Family: Interface-Drivers,Receivers,Transceivers; Duplex: Half; Package Reference: SOT96-1; Mounting Type: SurfaceMount; Number of Drivers/Receivers: 1/1; Package / Case: 8-SOIC(0.154quot;,3.90mmWidth); Product Training Modules: CANandLINBusTransceiver; Package Description: 8-Pin Small Outline Integrated Circuit, Body 4.9 x 3.9 mm, Pitch 1.27 mm; Protocol: CAN; Receiver Hysteresis: 70mV; Package/Case: 8-SOIC(0.154quot;,3.90mmWidth); Supplier Device Package: 8-SO; <PCN>: http://media.digikey.com/pdf/PCNs/NXP/201209019F04_TJA1050_Obs.pdf; Minimum Quantity: Transceiver; Voltage - Supply: 4.75V~5.25V; Dynamic Catalog: CANTransceivers; Other Names: 568-10292-1; Datasheet URL: http://www.nxp.com/documents/data_sheet/TJA1050.pdf; Category: IntegratedCircuits(ICs); PCN Packaging: LighterPackingReels30/Mar/2014; Quantity Available: CutTape(CT)AlternatePackaging; Datasheet Version: Rev. 4, 10/2003; Packaging: CutTape(CT); Manufacturer URL: http://www.nxp.com/; Origin Footprint 2: NXP-SOT96-1_N; Origin Footprint 3: NXP-SOT96-1_L
U19 = CH340N: LCSC Part Name: USB转串口芯片 CH340; Supplier Part: C2977777; Manufacturer: WCH(南京沁恒); Supplier Footprint: SOP-8; JLCPCB Part Class: Extended Part; Datasheet: https://atta.szlcsc.com/upload/public/pdf/source/20230530/6E401E9554E9F5311886CC8B3F89B62E.pdf; Supplier: LCSC; Library Name: 接口芯片
U23 = STM32G431RBT6: CPU内核:ARM-M系列;CPU最大主频:170MHz;工作电压范围:1.71V~3.6V;程序存储容量:128KB;GPIO端口数量:52;; Supplier Part: C431633; Manufacturer: ST(意法半导体); Supplier Footprint: LQFP-64(10x10); JLCPCB Part Class: Extended Part; Datasheet: https://atta.szlcsc.com/upload/public/pdf/source/20190925/C431633_8068E60CC825A086DCCD86A4BDED9458.pdf; Supplier: LCSC; CPU Core: ARM-M系列; CPU Maximum Speed: 170MHz; Operating Voltage Range: 1.71V~3.6V; Program Storage Size: 128KB; GPIO Ports Number: 52; ADC (Bit): 12bit; DAC (Bit): 12bit; Watchdog: 有; Infrared Data Association: 有; Low-Voltage Detect: 有; Direct Memory Access: 有; Internal Oscillator: 有; Operating Temperature Range: -40℃~+85℃
U24 U28 = DRV8313PWPR: 类型:无刷直流BLDC;电源电压:8V~60V;输出电流:-;接口:并行;; LCSC Part Name: 无刷直流BLDC电机驱动芯片 60V; Supplier Part: C92482; Manufacturer: TI(德州仪器); Supplier Footprint: TSSOP-28-EP; JLCPCB Part Class: Extended Part; Datasheet: https://www.ti.com/cn/lit/gpn/drv8313; Supplier: LCSC; Type: 无刷直流BLDC; Supply Voltage: 8V~60V; Interface: 并行; Operating Temperature: -40℃~+150℃@(Tj); Origin Footprint 1: FP-PWP0028C-IPC_B; Design Item ID: CMP-04915-000025-1; Library Name: Altium Content Vault; Min Operating Temperature: -40°C; Min Supply Voltage: 8V; Max Operating Temperature: 125°C; Max Supply Voltage: 60V; Mount: Surface Mount; Lead Free: Lead Free; Package Quantity: 2000; Number of Pins: 28; Case/Package: HTSSOP; Number of Outputs: 1; Logic Function: AND GATE; Packaging: Tape and Reel; Origin Footprint 2: FP-PWP0028C-IPC_A; Origin Footprint 3: FP-PWP0028C-IPC_C; Origin Footprint 4: FP-PWP0028C-MFG
U25-U27 U29-U31 = INA199A1DCKR: INA199 26V、双向、零漂移、低侧/高侧、电压输出分流监控器; Supplier Part: C59135; Manufacturer: TI(德州仪器); Supplier Footprint: SOT-363; JLCPCB Part Class: Extended Part; Datasheet: https://www.ti.com/cn/lit/gpn/ina199; Supplier: LCSC; Supply Current: 300uA; Supply Voltage: -300mV~26V; Operating Temperature: -40℃~+125℃; Origin Footprint 1: FP-DCK0006A-IPC_A; Design Item ID: CMP-0704-00049-3; Library Name: Altium Content Vault; Origin Footprint 2: FP-DCK0006A-IPC_C; Origin Footprint 3: FP-DCK0006A-IPC_B; Origin Footprint 4: FP-DCK0006A-MFG
U32-U34 = ZX-XH2.54-3PZZ: 参考系列:XH;间距:2.54mm;插针结构:1x3P;排数:1;每排PIN数:3;行距:-;公母:公型插针;安装方式:直插;额定电流:3A;触头材质:黄铜;触头镀层:锡;工作温度范围:-25℃~+85℃;焊接温度(最大值):260℃;; LCSC Part Name: 系列:XH 间距:2.54mm 1x3P 直插; Supplier Part: C7429633; Manufacturer: Megastar(兆星); Supplier Footprint: 插件,P=2.54mm; JLCPCB Part Class: Extended Part; Datasheet: https://atta.szlcsc.com/upload/public/pdf/source/20230619/AE17037A2CFDBE8D9CBA775D61AD0A84.pdf; Supplier: LCSC; Reference Series: XH; Pitch: 2.54mm; Pins Structure: 1x3P; Number of Rows: 1; Number of PINs Per Row: 3; Gender: 公型插针; Mounting Style: 直插; Current Rating (Max): 3A; Contact Material: 黄铜; Contact Plating: 锡; Operating Temperature Range: -25℃~+85℃; Welding Temperature (Max): 260℃
USB1 = TYPE-C 16PIN 2MD(073): 连接器类型:Type-C;标准:-;公母:母座;触点数量:16;端口数量:1;安装方式:卧贴;额定电流 - 电源:5A;工作温度范围:-25℃~+85℃;; LCSC Part Name: TYPE-C母座 16P 4脚插件带定位柱 不锈钢外壳 2次模顶; Supplier Part: C2765186; Manufacturer: SHOU HAN(首韩); Supplier Footprint: SMD; JLCPCB Part Class: Extended Part; Supplier: LCSC; Connector Type: Type-C; Gender: 母座; Number of Contacts: 16; Number of Ports: 1; Mounting Style: 卧贴; Current Rating - Power (Max): 5A; Operating Temperature Range: -25℃~+85℃
X4 = CSTCE8M00G55-R0: 频率:8MHz;频率容差:±0.5%;内置负载电容:33pF;谐振阻抗:-;; LCSC Part Name: 8M ±0.5% 33pF 停产; Supplier Part: C70457; Manufacturer: muRata(村田); Supplier Footprint: SMD3213-3P; JLCPCB Part Class: Extended Part; Datasheet: https://atta.szlcsc.com/upload/public/pdf/source/20160405/1459820110334.pdf; Supplier: LCSC; Frequency Stability: ±0.2%; Frequency Tolerance: ±0.5%; Built-in Load Capacitance: 33pF; Operating Temperature: -20℃~+80℃; Design Item ID: CMP-2100-03620-1; Library Name: Altium Content Vault; Datasheet Version: 42339.0; Capacitance: 33pF; RoHSCompliant: True; Datasheet URL: http://www.murata.com/~/media/webrenewal/support/library/catalog/products/timingdevice/ceralock/p16e.ashx; Case/Package: Ceramic; Load Capacitance: 33pF; Tolerance: 0.5%; Mount: SurfaceMount; Height: 0.031inch; Number of Pins: 3; Package Description: 3-Pin Surface Mount Device, Body 3.2 x 1.3 mm, Pitch 1.2 mm; Package Quantity: 1; Lead Free: LeadFree; Contact Plating: Gold; REACH SVHC: NoSVHC; Length: 0.126inch; Width: 0.051inch; Manufacturer URL: http://www.murata.com/; Packaging: TapeandReel; Termination: SMD/SMT; Max Operating Temperature: 80degC; Composition: Ceramic; Package Reference: CSTCE_G_A-3; Min Operating Temperature: -20degC
X5 X6 = AFC10-S03QCA-00: 参考系列:SH;间距:1mm;插针结构:1x3P;排数:1;每排PIN数:3;行距:-;公母:公型插针;安装方式:卧贴;额定电流:500mA;工作温度范围:-25℃~+85℃;; LCSC Part Name: 系列:SH 间距:1mm 1x3P 卧贴; Supplier Part: C2764182; Manufacturer: JS(钜硕电子); Supplier Footprint: SMD,P=1mm; JLCPCB Part Class: Extended Part; Datasheet: https://atta.szlcsc.com/upload/public/pdf/source/20210330/C2764181_391AED87194E28CE940989A69A8EDCC4.pdf; Supplier: LCSC; Reference Series: SH; Pitch: 1mm; Pins Structure: 1x3P; Number of Rows: 1; Number of PINs Per Row: 3; Gender: 公型插针; Mounting Style: 卧贴; Current Rating (Max): 500mA; Operating Temperature Range: -25℃~+85℃

## Nets
+1.65V: R62.1 R63.2 U25.1(REF) U26.1(REF) U27.1(REF)
+1.65V_2: R70.1 R71.2 U29.1(REF) U30.1(REF) U31.1(REF)
+3V3: C49.1 C53.1 C54.1 C55.1 C61.1 C62.1 C63.1 FPC4.1 FPC4.7 H2.1 JP7.4 R33.2 R34.1 R35.1 R44.1 R45.1 R46.1 R47.1 R53.1 R59.2 R60.2 R61.2 R62.2 R67.2 R68.2 R69.2 R70.2 U13.2(OUT) U23.1(VBAT) U23.16(VDD) U23.28(VREF+) U23.29(VDDA) U23.32(VDD) U23.48(VDD) U23.64(VDD) U25.3(V+) U26.3(V+) U27.3(V+) U29.3(V+) U30.3(V+) U31.3(V+)
GND: C26.1 C27.1 C29.1 C30.1 C32.1 C41.2 C42.2 C43.2 C44.2 C45.2 C46.1 C47.2 C48.2 C49.2 C50.2 C51.1 C52.1 C53.2 C54.2 C55.2 C58.1 C59.1 C60.1 C61.2 C62.2 C63.2 C66.1 CN1.1(-) CN1.3 CN1.4 CN2.2 CN3.2 D4.1(A) FPC4.2 H2.3 JP7.3 LED3.2(K) R27.1 R30.1 R51.2 R52.2 R63.1 R71.1 S3.1 SW5.2 SW5.3 SW6.2 SW6.3 SW7.2 SW7.3 SW8.2 SW8.3 SW9.2 SW9.3 SW10.C SW10.E U12.1(GND) U13.1(GND) U18.2(GND) U18.8(S) U19.3(GND) U23.15(VSS) U23.27(VSSA) U23.31(VSS) U23.47(VSS) U23.63(VSS) U24.6(PGND1) U24.7(PGND2) U24.10(PGND3) U24.14(GND) U24.20(GND) U24.28(GND) U24.29(Thermal pad) U25.2(GND) U26.2(GND) U27.2(GND) U28.6(PGND1) U28.7(PGND2) U28.10(PGND3) U28.14(GND) U28.20(GND) U28.28(GND) U28.29(Thermal pad) U29.2(GND) U30.2(GND) U31.2(GND) U32.3 U33.3 U34.1 USB1.1(GND) USB1.12(GND) USB1.13(SHELL) USB1.14(SHELL) X4.2(GND)
VBUS: D3.1(A) USB1.2(VBUS) USB1.11(VBUS)
